# Altium schematic sheet DACs.SchDoc: Shuttler
size 420 x 297 mm; Author: G.Kasprowicz; CompanyName: WUT ISE; DrawnBy: G.Kasprowicz; Organization: WUT ISE; Address1: PW ISE; Address2: Nowowiejska 15/19 00-665 Warsaw; Address3: gkasprow@gmail.com; DocumentNumber: 5; SheetNumber: 5; SheetTotal: 10; ModifiedBy: -; CheckedDate: -; Title2: DAC; DivGrp: WUT ISE; Designer: G.Kasprowicz; ModifiedDate: -; ProjectName: Sensor Box
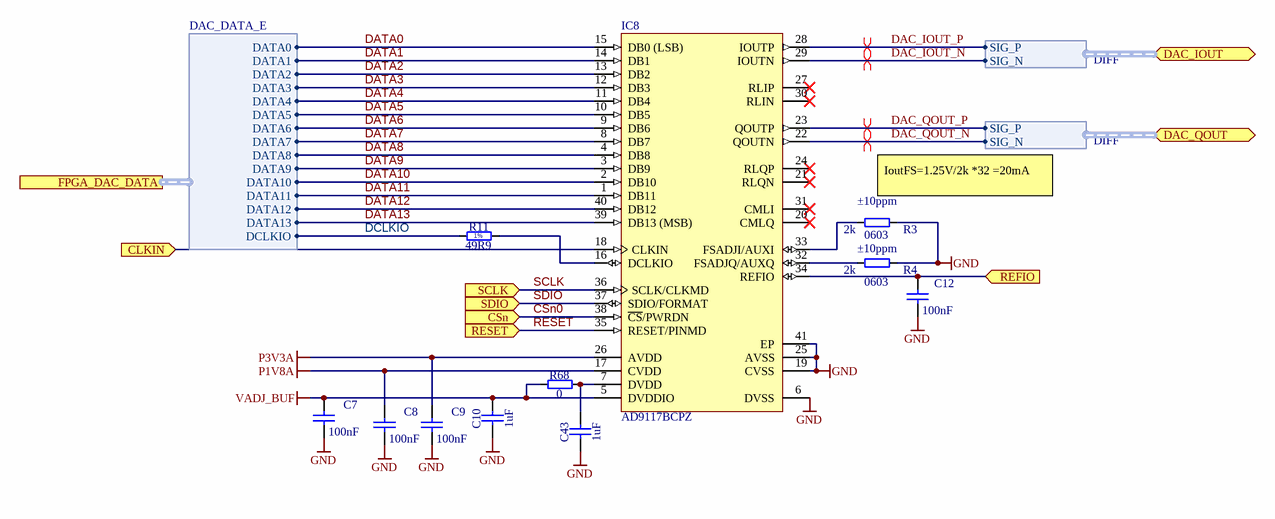
[diagram p0: DACs.SchDoc]

## Parts
C7  100nF  [CAPC1005X55N]
C8  100nF  [CAPC1005X55N]
C9  100nF  [CAPC1005X55N]
C10  1uF  [CAPC1608X87N]
C12  100nF  [CAPC1005X55N]
C43  1uF  [CAPC1608X87N]
IC8  AD9117BCPZ  [CP-40-1_N]
R3  2k  TC: ±10ppm  Case: 0603  [RESC1608X55N]
R4  2k  TC: ±10ppm  Case: 0603  [RESC1608X55N]
R11  49R9  [RESC0603X28N]
R68  0  [RESC1005X40N]

## Ports
CLKIN (in), CSn (in), DAC_IOUT (bidir, harness DIFF), DAC_QOUT (bidir, harness DIFF), FPGA_DAC_DATA (harness DAC_DATA_E), REFIO (in), RESET (in), SCLK (in), SDIO (in)

## Harnesses
DIFF: SIG_P, SIG_N
DAC_DATA_E: DATA0, DATA1, DATA2, DATA3, DATA4, DATA5, DATA6, DATA7, DATA8, DATA9, DATA10, DATA11, DATA12, DATA13, DCLKIO

## Nets
GND: C7.2 C8.2 C9.2 C10.1 C12.2 C43.1 IC8.6(DVSS) IC8.19(CVSS) IC8.25(AVSS) IC8.41(EP) R3.2 R4.2
P1V8A: C8.1 IC8.17(CVDD)
P3V3A: C9.1 IC8.26(AVDD)
VADJ_BUF: C7.1 C10.2 IC8.5(DVDDIO) R68.1
CLKIN: IC8.18(CLKIN) ; port CLKIN
CSn0: IC8.38(~{CS}/PWRDN) ; port CSn
DAC_IOUT_N: IC8.29(IOUTN) ; port DAC_IOUT.SIG_N
DAC_IOUT_P: IC8.28(IOUTP) ; port DAC_IOUT.SIG_P
DAC_QOUT_N: IC8.22(QOUTN) ; port DAC_QOUT.SIG_N
DAC_QOUT_P: IC8.23(QOUTP) ; port DAC_QOUT.SIG_P
DATA0: IC8.15(DB0_(LSB)) ; port FPGA_DAC_DATA.DATA0
DATA1: IC8.14(DB1) ; port FPGA_DAC_DATA.DATA1
DATA2: IC8.13(DB2) ; port FPGA_DAC_DATA.DATA2
DATA3: IC8.12(DB3) ; port FPGA_DAC_DATA.DATA3
DATA4: IC8.11(DB4) ; port FPGA_DAC_DATA.DATA4
DATA5: IC8.10(DB5) ; port FPGA_DAC_DATA.DATA5
DATA6: IC8.9(DB6) ; port FPGA_DAC_DATA.DATA6
DATA7: IC8.8(DB7) ; port FPGA_DAC_DATA.DATA7
DATA8: IC8.4(DB8) ; port FPGA_DAC_DATA.DATA8
DATA9: IC8.3(DB9) ; port FPGA_DAC_DATA.DATA9
DATA10: IC8.2(DB10) ; port FPGA_DAC_DATA.DATA10
DATA11: IC8.1(DB11) ; port FPGA_DAC_DATA.DATA11
DATA12: IC8.40(DB12) ; port FPGA_DAC_DATA.DATA12
DATA13: IC8.39(DB13_(MSB)) ; port FPGA_DAC_DATA.DATA13
DCLKIO: R11.1 ; port FPGA_DAC_DATA.DCLKIO
REFIO: C12.1 IC8.34(REFIO) ; port REFIO
RESET: IC8.35(RESET/PINMD) ; port RESET
SCLK: IC8.36(SCLK/CLKMD) ; port SCLK
SDIO: IC8.37(SDIO/FORMAT) ; port SDIO
NetC43_2: C43.2 IC8.7(DVDD) R68.2
NetIC8_16: IC8.16(DCLKIO) R11.2
NetIC8_32: IC8.32(FSADJQ/AUXQ) R4.1
NetIC8_33: IC8.33(FSADJI/AUXI) R3.1

Not connected (* = marked no-connect by the designer): IC8 20(CMLQ)* 21(RLQN)* 24(RLQP)* 27(RLIP)* 30(RLIN)* 31(CMLI)*

## Layout directives
differential pair: DAC_IOUT_N, DAC_IOUT_P, DAC_QOUT_N, DAC_QOUT_P

## Notes on the sheet
- (near R3) IoutFS=1.25V/2k *32 =20mA
- Project/Equipment
- Document
- Designer
- Drawn by
- Check.by
- Copyright WUT ISE 2018.
  This documentation describes Open Hardware and is licensed under the CERN OHL v.1.1. You may redistribute and modify this documentation under the terms of the CERN OHL v.1.1. (http://ohwr.org/CERNOHL). This documentation is distributed WITHOUT ANY EXPRESS OR IMPLIED WARRANTY, INCLUDING OF MERCHANTABILITY, SATISFACTORY QUALITY AND FITNESS FOR A PARTICULAR PURPOSE. Please see the CERN OHL v.1.1 for applicable conditions.
- Contact
- File
- Last Mod.
- Print Date
- Sheet
- Size
- A3
- of
- Rev
- (in symbol R0201_49R9_1%_0.05W_200PPM) 1%

## Library data of the parts
C7-C9 C12 = CC0402_100NF_16V_10%_X7R: Non-polarised capacitor; Part Description: SMD Multilayer Chip Ceramic Capacitor; Manufacturer: GENERIC; Manufacturer1 Part Number: GRM155R71C104KA88D; Voltage: 16V; TC: X7R; Tolerance: ±10%; Table: Capacitors SMD; Part Number: CC0402_100NF_16V_10%_X7R; Component Kind: Standard; Component Type: Standard; Pin Count: 2; Value: 100nF; Status: Not Recommended; Manufacturer Part Number: CC0402_100NF_16V_10%_X7R; Case: 0402; Mounted: Yes; Socket: No; SMD: Yes; Manufacturer1 Example: MURATA; Manufacturer1 ComponentHeight: 0.55mm; HelpURL: \\cern.ch\dfs\Applications\Altium\Datasheets\CC0402_X7R_MURATA_GRM.pdf; Author: CERN DEM JLC; CreateDate: 2013-12-05; LatestRevisionDate: 2007-12-03
C10 C43 = CC0603_1UF_25V_10%_X7R: Non-polarised capacitor; Part Description: SMD Multilayer Chip Ceramic Capacitor; Manufacturer: GENERIC; Manufacturer1 Part Number: GRM188R71E105KA12D; Voltage: 25V; TC: X7R; Tolerance: ±10%; Part Number: CC0603_1UF_25V_10%_X7R; Component Kind: Standard; Component Type: Standard; Pin Count: 2; Value: 1uF; Status: None; Manufacturer Part Number: CC0603_1UF_25V_10%_X7R; Case: 0603; Mounted: Yes; Socket: No; SMD: Yes; Sense: No; Manufacturer1 Example: MURATA; Manufacturer1 ComponentHeight: 0.9mm; HelpURL: \\cern.ch\dfs\Applications\Altium\Datasheets\CC0603_X7R_MURATA.pdf; Author: CERN DEM JLC; CreateDate: 18/01/2011; LatestRevisionDate: 18/01/2011
IC8 = CMP-0318-00565-2: Dual 14-Bit Low Power TxDAC Digital-to-Analog Converter, 0 to +70 degC, CP-40-1, Pb-Free, Tray; Manufacturer: Analog Devices; Generic Part Number: AD9117; Max V+: 3.3V; Single Supply: Yes; # DAC Outputs: 2; Resolution (Bits): 14; ComponentLink4Description: Product URL; ComponentLink2URL: http://www.analog.com/static/imported-files/data_sheets/AD9114_9115_9116_9117.pdf; Packing: Tray; PackageDescription: 40-Pin Lead Frame Chip Scale Package [LFCSP_VQ] Very Thin Quad; PackageVersion: Oct-2006; ComponentLink1URL: http://www.analog.com/en/index.html; Mounting Technology: Surface Mount; ComponentLink5URL: http://www.analog.com/en/digital-to-analog-converters/da-converters/ad9117/products/product.html#prod_cross_sell; ComponentLink3Description: Package Specification; PartNumber: AD9117BCPZ; PackageReference: CP-40-1; ComponentLink1Description: Manufacturer URL; ComponentLink4URL: http://www.analog.com/en/digital-to-analog-converters/da-converters/ad9117/products/product.html; ComponentLink3URL: http://www.analog.com/static/imported-files/packages/PKG_PDF/LFCSP(CP)/CP_40_1.pdf; ComponentLink2Description: Datasheet; ComponentLink5Description: Reference Design URL; Code_JEDEC: MO-220-VJJD-2; RoHS: Y; RevisionNote: Component URL fixed; DatasheetVersion: Rev.B
R3 R4 = R0603_2K_0.1%_0.063W_10PPM: Resistor - 0.1%; Part Description: Thin Film Chip Resistor; Manufacturer: GENERIC; Manufacturer1 Part Number: RN73C1J2K0BTDF; Power: 0.063W; PressFit: No; Part Number: R0603_2K_0.1%_0.063W_10PPM; Component Kind: Standard; Component Type: Standard; Pin Count: 2; Value: 2k; Status: Not Recommended; Tolerance: ±0.1%; Manufacturer Part Number: R0603_2K_0.1%_0.063W_10PPM; Mounted: Yes; Sense: No; Socket: No; SMD: Yes; Manufacturer1 Example: TYCO HOLSWORTHY; Manufacturer1 ComponentHeight: 0.5mm; HelpURL: \\cern.ch\dfs\Applications\Altium\Datasheets\R0603_Tyco_RN73.pdf; Author: CERN DEM JLC; CreateDate: 03.12.2007; LatestRevisionDate: 13.03.2008
R11 = R0201_49R9_1%_0.05W_200PPM: Resistor - 1%; Part Description: Thick Film Chip Resistor; Manufacturer: GENERIC; Manufacturer1 Part Number: CRCW020149R9FNED; Power: 0.05W; TC: ±200ppm/°C; PressFit: No; Part Number: R0201_49R9_1%_0.05W_200PPM; Component Kind: Standard; Component Type: Standard; Pin Count: 2; Value: 49R9; Status: Not Recommended; Tolerance: ±1%; Manufacturer Part Number: R0201_49R9_1%_0.05W_200PPM; Case: 0201; Mounted: Yes; Sense: No; Socket: No; SMD: Yes; Manufacturer1 Example: VISHAY; Manufacturer1 ComponentHeight: 0.27mm; HelpURL: \\cern.ch\dfs\Applications\Altium\Datasheets\R0201_VISHAY_CRCW e3.pdf; Author: CERN DEM BC; CreateDate: 10/01/2020; LatestRevisionDate: 10/01/2020
R68 = R0402_0R_JUMPER: Resistor; Part Description: 1A (0.05R Max DC Resistance) Zero Ohm Jumper; Manufacturer: GENERIC; Manufacturer1 Part Number: 232270591001L; PressFit: No; Part Number: R0402_0R_JUMPER; Component Kind: Standard; Component Type: Standard; Pin Count: 2; Value: 0; Status: Not Recommended; Manufacturer Part Number: R0402_0R_JUMPER; Case: 0402; Mounted: Yes; Sense: No; Socket: No; SMD: Yes; Manufacturer1 Example: YAGEO PHYCOMP; Manufacturer1 ComponentHeight: 0.4mm; HelpURL: \\cern.ch\dfs\Applications\Altium\Datasheets\R0402_Phycomp_RC0402.pdf; Author: CERN DEM JLC; CreateDate: 03.12.2007; LatestRevisionDate: 17.10.2012